# EasyEDA schematic Schematic_Tree keychain.json
TITLE: Tree Keychain V1; REV: 1.1; Date: 2024-04-15; Sheet: 1/1; Drawn By: Flavius M. De Jesu; Company: Flavius
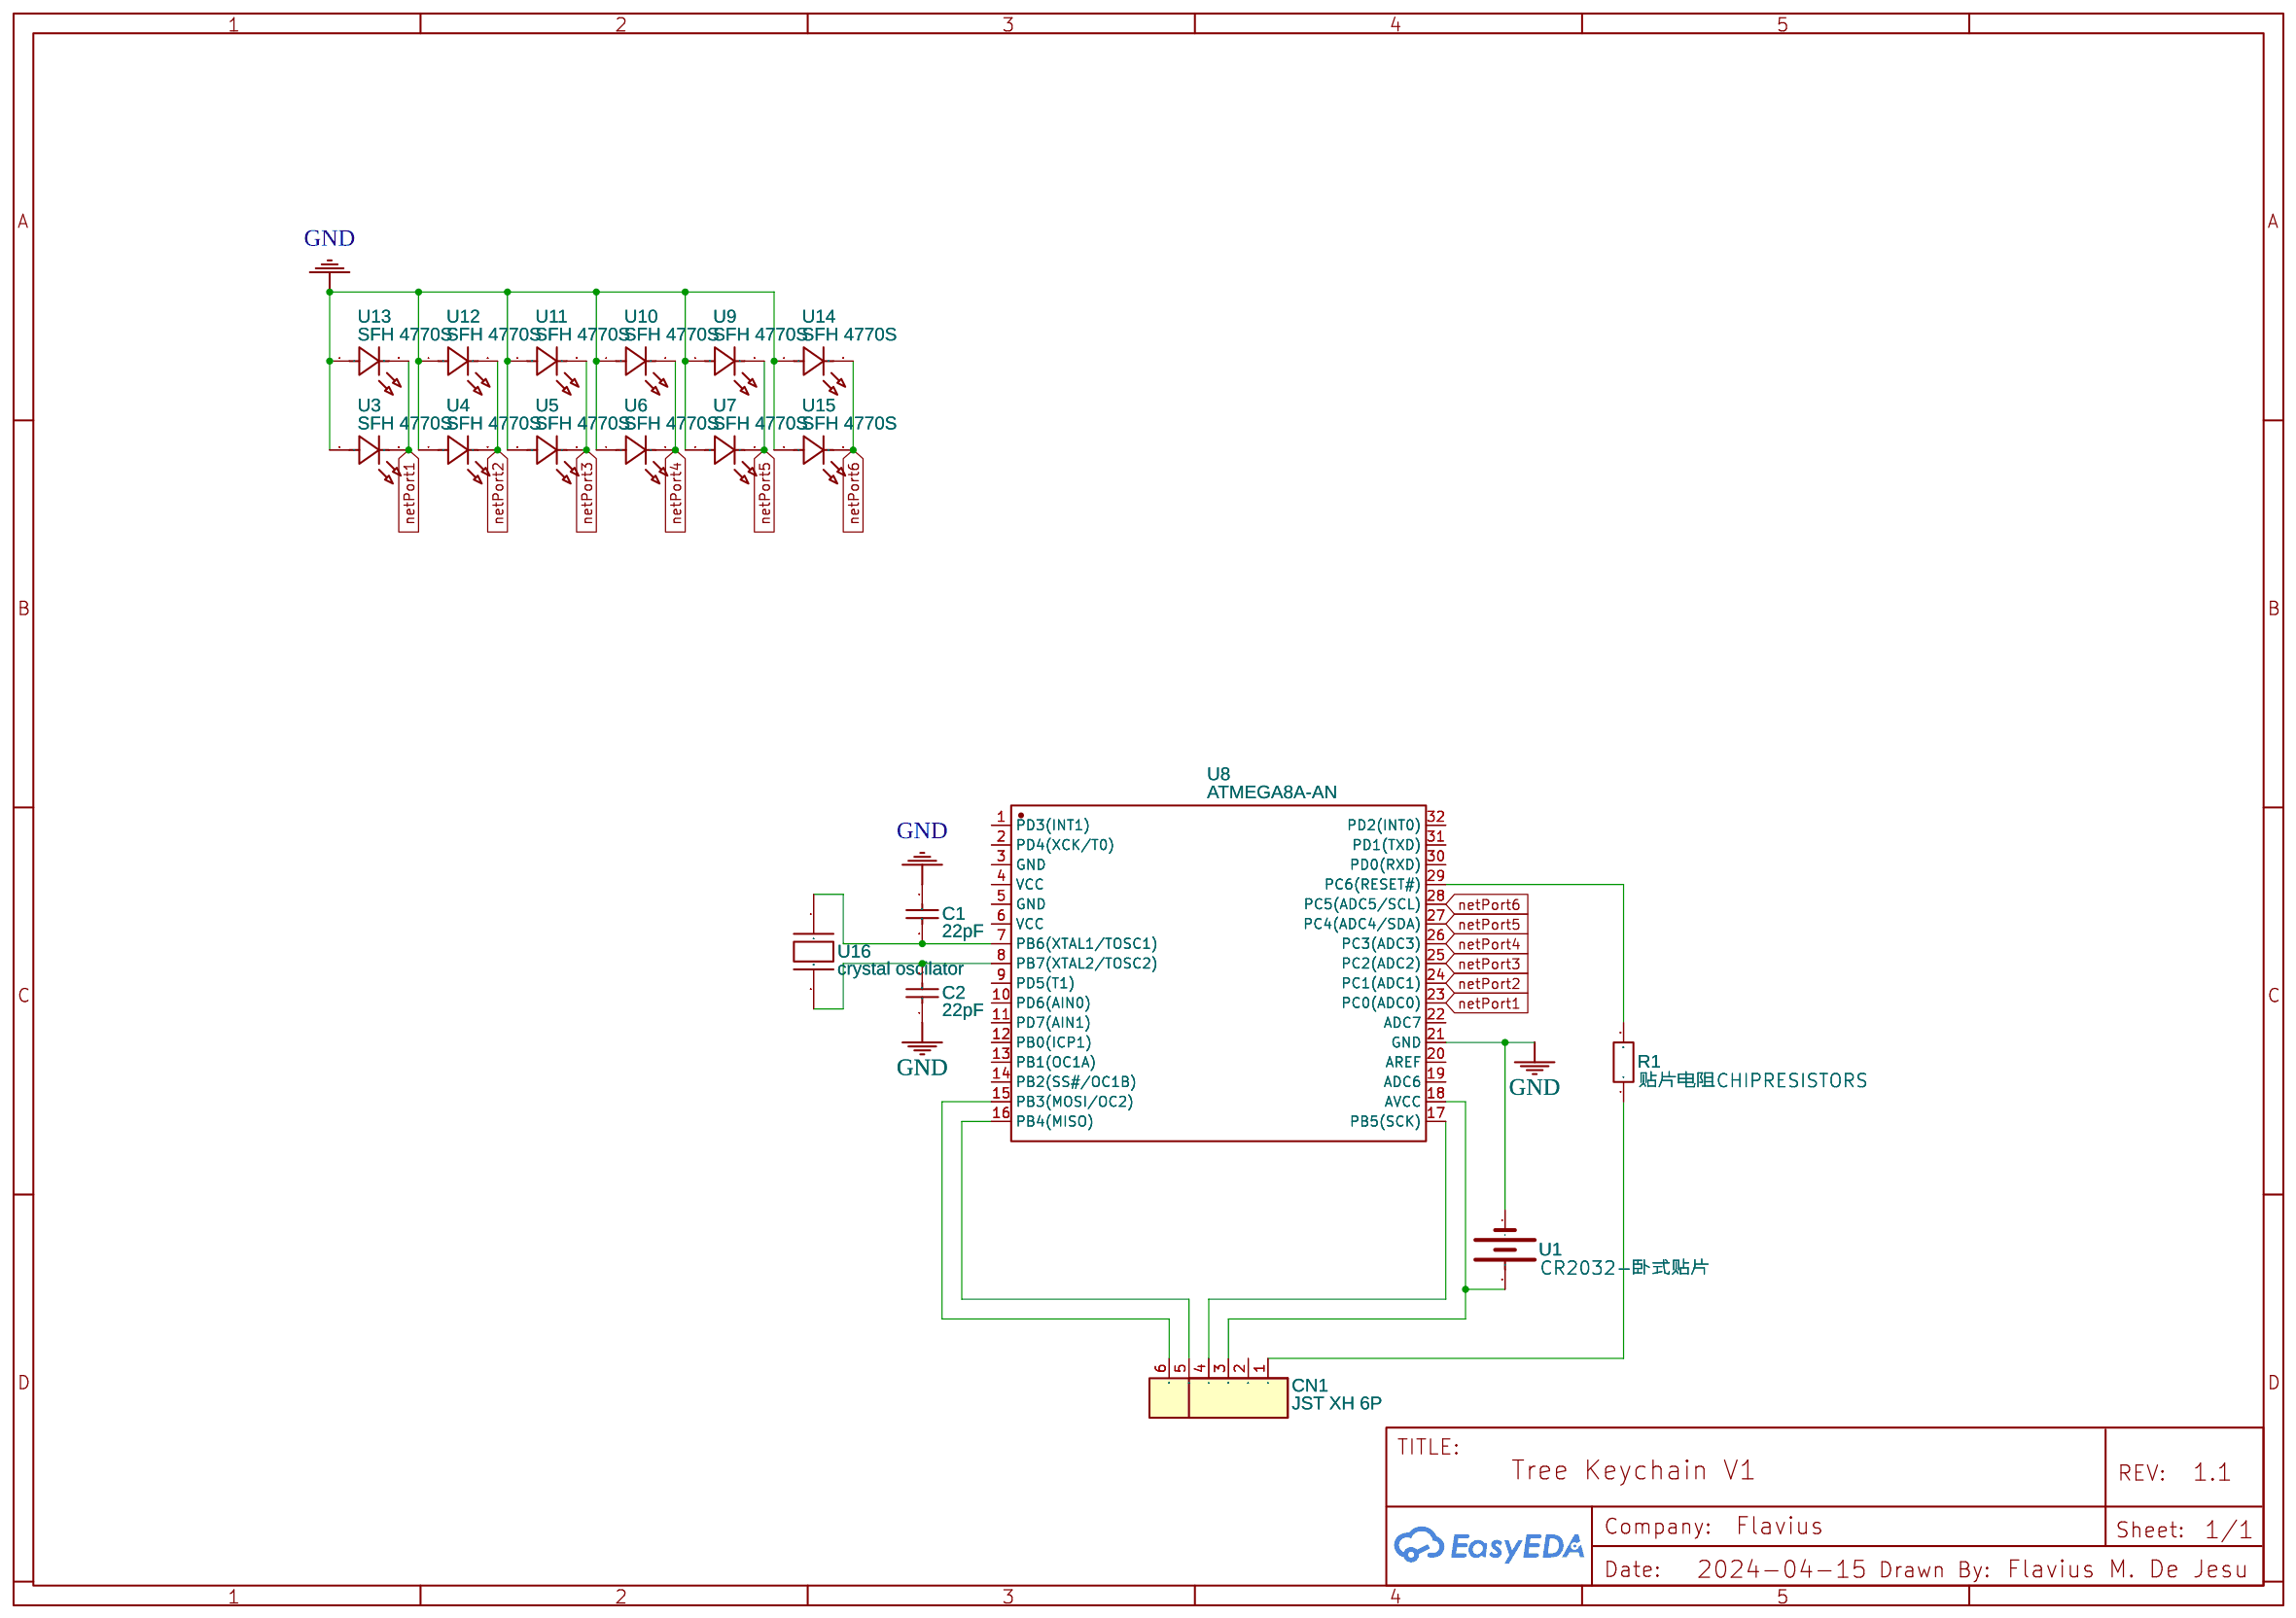
[diagram p0: schematic sheet]

## Parts
C1  22pF  [CAP-TH_L3.5-W3.0-P2.54-D0.8]
C2  22pF  [CAP-TH_L3.5-W3.0-P2.54-D0.8]
CN1  JST XH 6P  [CN_HDR_1X6_180D_P25_JST_B6B-XH]
R1  贴片电阻CHIPRESISTORS  [R0603]
U1  CR2032-卧式贴片  [BAT-SMD_CR2032-C9900005595]
U3  SFH 4770S  [LED-SMD_L2.8-W2.0-RD-LEDSVY-ASS]
U4  SFH 4770S  [LED-SMD_L2.8-W2.0-RD-LEDSVY-ASS]
U5  SFH 4770S  [LED-SMD_L2.8-W2.0-RD-LEDSVY-ASS]
U6  SFH 4770S  [LED-SMD_L2.8-W2.0-RD-LEDSVY-ASS]
U7  SFH 4770S  [LED-SMD_L2.8-W2.0-RD-LEDSVY-ASS]
U8  ATMEGA8A-AN  [TQFP-32_L7.0-W7.0-P0.80-LS9.0-BL]
U9  SFH 4770S  [LED-SMD_L2.8-W2.0-RD-LEDSVY-ASS]
U10  SFH 4770S  [LED-SMD_L2.8-W2.0-RD-LEDSVY-ASS]
U11  SFH 4770S  [LED-SMD_L2.8-W2.0-RD-LEDSVY-ASS]
U12  SFH 4770S  [LED-SMD_L2.8-W2.0-RD-LEDSVY-ASS]
U13  SFH 4770S  [LED-SMD_L2.8-W2.0-RD-LEDSVY-ASS]
U14  SFH 4770S  [LED-SMD_L2.8-W2.0-RD-LEDSVY-ASS]
U15  SFH 4770S  [LED-SMD_L2.8-W2.0-RD-LEDSVY-ASS]
U16  crystal oscilator  [CRYSTAL-OSCILATOR_DIGIKEY PART NO. CTX414-ND]

## Library data of the parts
C1 C2 = 22pf/50V 10%: Supplier: LCSC; Manufacturer: ReliaPro; Supplier Part: C9316; JLCPCB Part Class: Extended Part
CN1 = JST XH 6P: Supplier Part: C61277; Supplier: LCSC; Digi-Key: 455-2249-ND
R1 = 贴片电阻CHIPRESISTORS: Contributor: lcsc; Supplier: LCSC; Supplier Part: C9900014833; Manufacturer: null; Manufacturer Part: 贴片电阻ChipResistors; JLCPCB Part Class: Extended Part
U1 = CR2032-卧式贴片: Contributor: LCSC; Supplier: LCSC; Supplier Part: C9900005595; Manufacturer: null; JLCPCB Part Class: Extended Part
U3-U7 U9-U15 = SFH 4770S: Contributor: LCSC; Supplier: LCSC; Supplier Part: C2900429; Manufacturer: OSRAM(欧司朗); JLCPCB Part Class: Extended Part
U8 = ATMEGA8A-AN: Contributor: lcsc; Supplier: LCSC; Supplier Part: C5127755; Manufacturer: MICROCHIP(美国微芯)
U16 = crystal oscilator: Contributor: pattanaikomkar

## Nets
GND: C1.1 C2.1 U1.1(-) U3.1(A) U4.1(A) U5.1(A) U6.1(A) U7.1(A) U8.21(GND) U9.1(A) U10.1(A) U11.1(A) U12.1(A) U13.1(A) U14.1(A) U15.1(A)
netPort1: U3.2(K) U8.23(PC0(ADC0)) U13.2(K)
netPort2: U4.2(K) U8.24(PC1(ADC1)) U12.2(K)
netPort3: U5.2(K) U8.25(PC2(ADC2)) U11.2(K)
netPort4: U6.2(K) U8.26(PC3(ADC3)) U10.2(K)
netPort5: U7.2(K) U8.27(PC4(ADC4/SDA)) U9.2(K)
netPort6: U8.28(PC5(ADC5/SCL)) U14.2(K) U15.2(K)
Net-(C1-2): C1.2 U8.7(PB6(XTAL1/TOSC1)) U16.1
Net-(C2-2): C2.2 U8.8(PB7(XTAL2/TOSC2)) U16.2
Net-(CN1-1): CN1.1 R1.1
Net-(CN1-3): CN1.3 U1.2(+) U8.18(AVCC)
Net-(CN1-4): CN1.4 U8.17(PB5(SCK))
Net-(CN1-5): CN1.5 U8.16(PB4(MISO))
Net-(CN1-6): CN1.6 U8.15(PB3(MOSI/OC2))
Net-(R1-2): R1.2 U8.29(PC6(RESET#))

Not connected (* = marked no-connect by the designer): CN1 2; U8 1(PD3(INT1)) 2(PD4(XCK/T0)) 3(GND) 4(VCC) 5(GND) 6(VCC) 9(PD5(T1)) 10(PD6(AIN0)) 11(PD7(AIN1)) 12(PB0(ICP1)) 13(PB1(OC1A)) 14(PB2(SS#/OC1B)) 19(ADC6) 20(AREF) 22(ADC7) 30(PD0(RXD)) 31(PD1(TXD)) 32(PD2(INT0))
